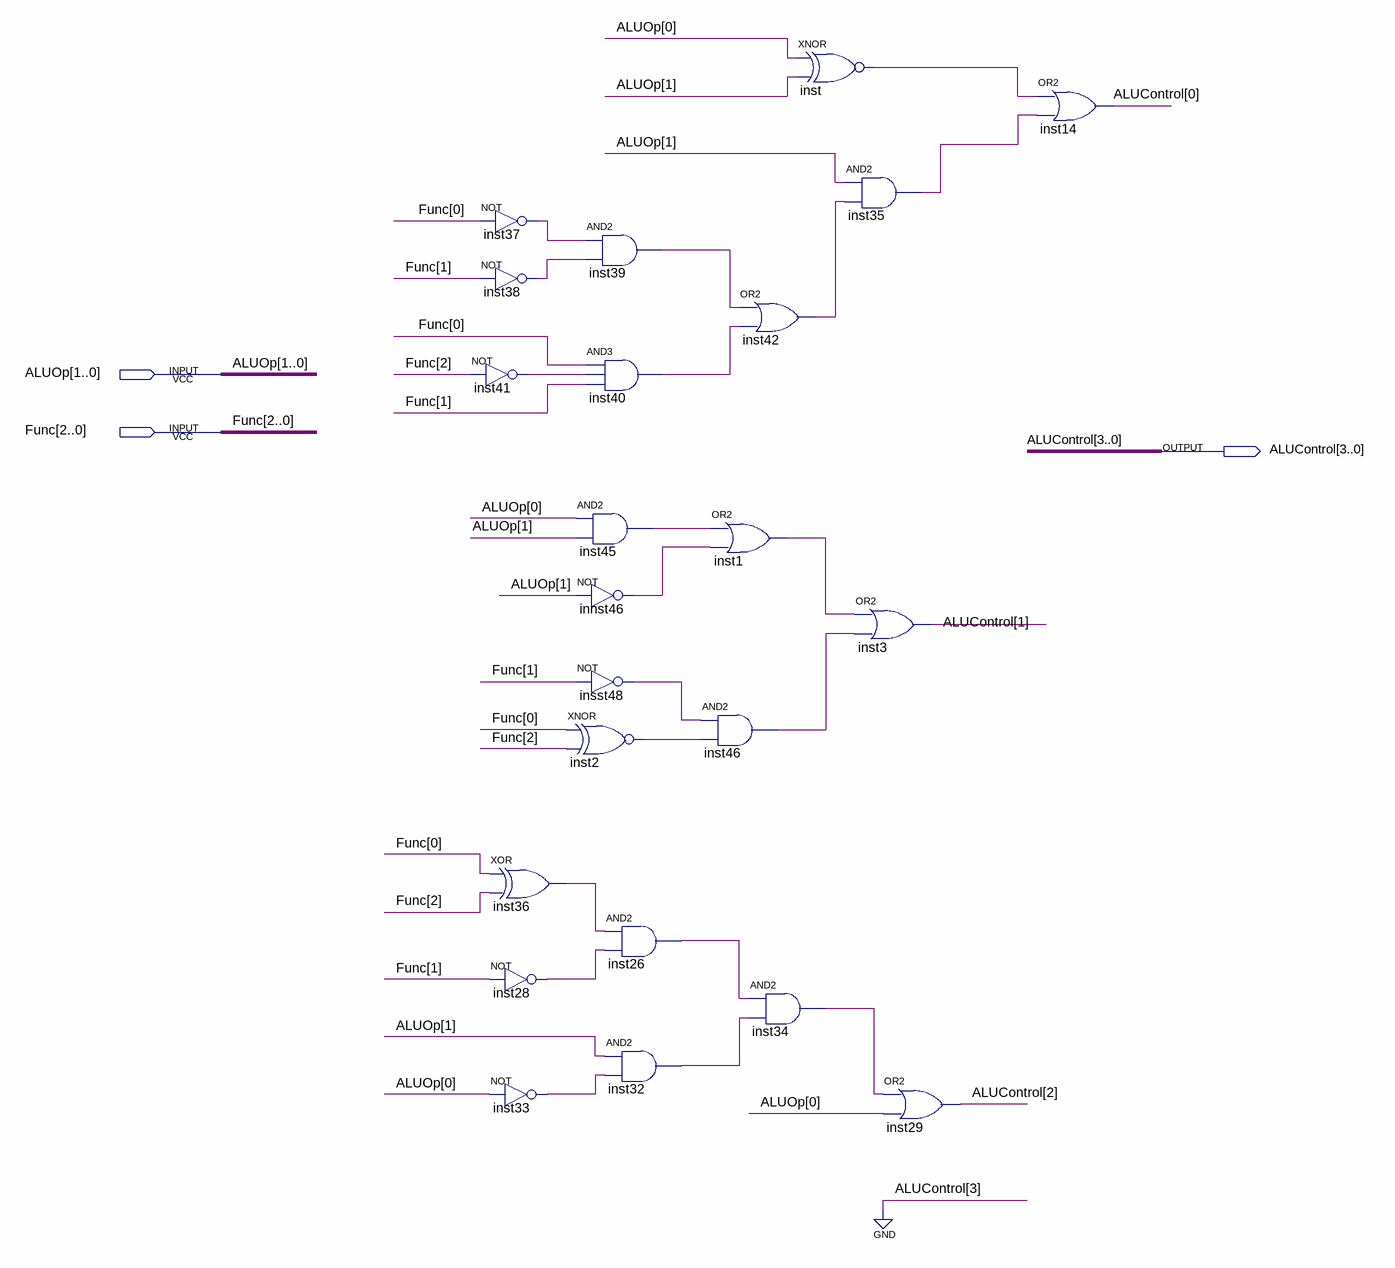
[diagram p0: schematic sheet]
// Quartus schematic ALUControlUnit.bdf as structural Verilog: 23 symbols, 3 pins
module ALUControlUnit (
  input  [1:0] ALUOp,
  input  [2:0] Func,
  output [3:0] ALUControl
);

  wire innst46_out, insst48_out, inst1_out, inst2_out, inst26_out, inst28_out, inst32_out, inst33_out,
       inst34_out, inst35_out, inst36_out, inst37_out, inst38_out, inst39_out, inst40_out, inst41_out,
       inst42_out, inst45_out, inst46_out, inst_out;

  not inst41 (inst41_out, Func[2]);
  not inst37 (inst37_out, Func[0]);
  not inst38 (inst38_out, Func[1]);
  xor inst36 (inst36_out, Func[0], Func[2]);
  not inst28 (inst28_out, Func[1]);
  not inst33 (inst33_out, ALUOp[0]);
  and inst39 (inst39_out, inst37_out, inst38_out);
  and inst40 (inst40_out, Func[0], inst41_out, Func[1]);
  and inst45 (inst45_out, ALUOp[0], ALUOp[1]);
  not innst46 (innst46_out, ALUOp[1]);
  not insst48 (insst48_out, Func[1]);
  xnor inst2 (inst2_out, Func[0], Func[2]);
  and inst26 (inst26_out, inst36_out, inst28_out);
  and inst32 (inst32_out, ALUOp[1], inst33_out);
  and inst46 (inst46_out, insst48_out, inst2_out);
  or inst42 (inst42_out, inst39_out, inst40_out);
  or inst1 (inst1_out, inst45_out, innst46_out);
  and inst34 (inst34_out, inst26_out, inst32_out);
  xnor inst (inst_out, ALUOp[0], ALUOp[1]);
  and inst35 (inst35_out, ALUOp[1], inst42_out);
  or inst3 (ALUControl[1], inst1_out, inst46_out);
  or inst29 (ALUControl[2], inst34_out, ALUOp[0]);
  or inst14 (ALUControl[0], inst_out, inst35_out);

  assign ALUControl[3] = 1'b0;
endmodule
